# EAGLE schematic G2G-U Module (EAGLE 7.2.0)
Grove-to-Gadgeteer Module
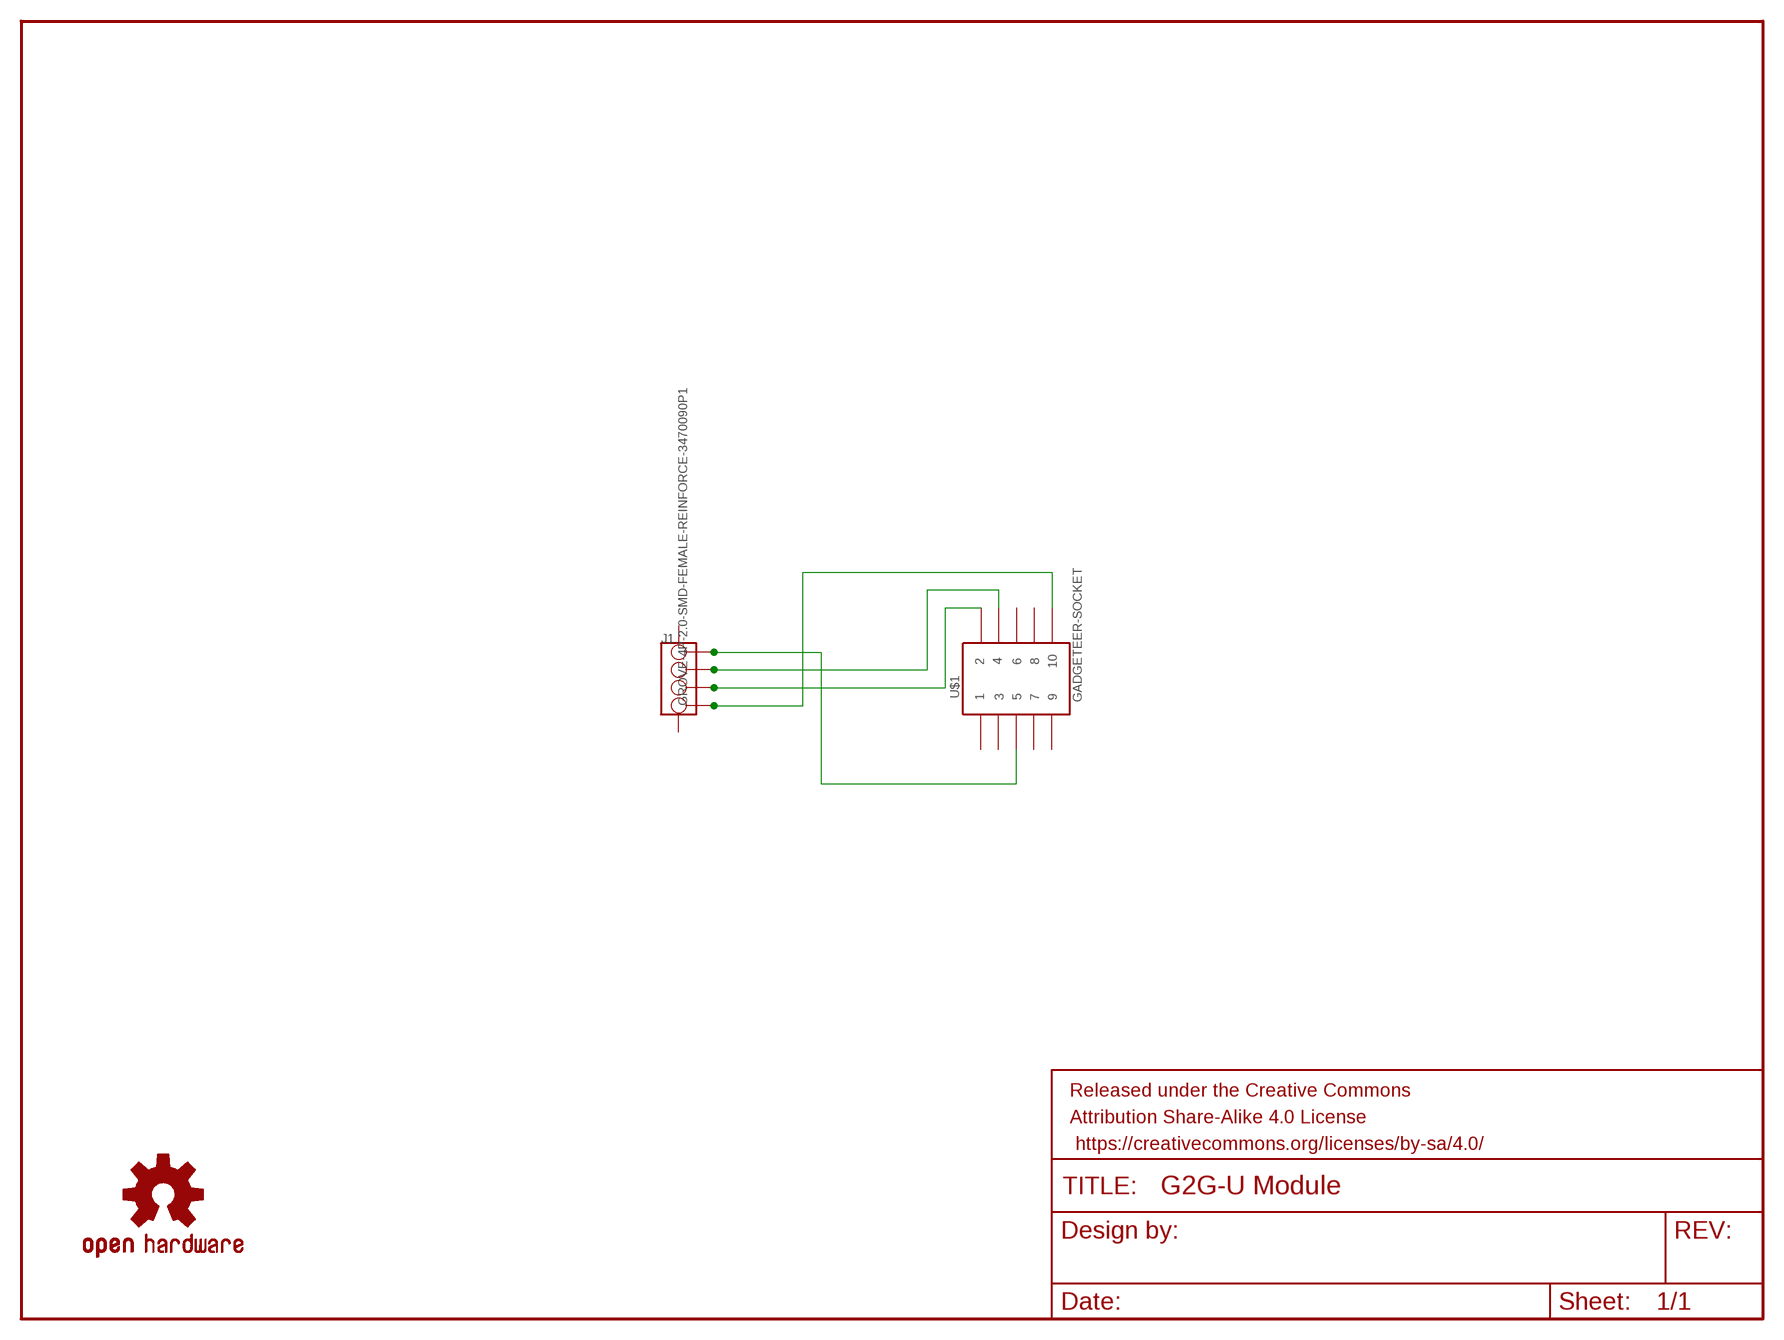
[diagram p0: schematic, sheet 1]

## Parts
FRAME1  FRAME-LETTER  [CREATIVE_COMMONS]
J1  GROVE-4P-2.0-SMD-FEMALE-REINFORCE-3470090P1  [4P-SMD-2.0]
LOGO1  OSHW-LOGOS  [OSHW-LOGO-S]
U$1  GADGETEER-SOCKET  [2X5_1.27MM]

## Nets
N$1: J1.1 U$1.5
N$2: J1.2 U$1.4
N$3: J1.3 U$1.2
N$4: J1.4 U$1.10
Unconnected: J1.SS1 J1.SS2 U$1.1 U$1.3 U$1.6 U$1.7 U$1.8 U$1.9

## Library data of the parts
FRAME1 = SparkFun-Aesthetics:FRAME-LETTER: Schematic Frame Standard 8.5x11 US Letter frame
J1 = Connector:GROVE-4P-2.0-SMD-FEMALE-REINFORCE
LOGO1 = SparkFun-Aesthetics:OSHW-LOGO: Open Source Hardware Logo This logo indicates the piece of hardware it is found on incorporates a OSHW license and/or adheres to the definition of open source hardware found here: http://freedomdefined.org/OSHW
U$1 = SoftDust:GADGETEER-SOCKET